# Altium project EnvMonitor V1.0a.PrjPcb
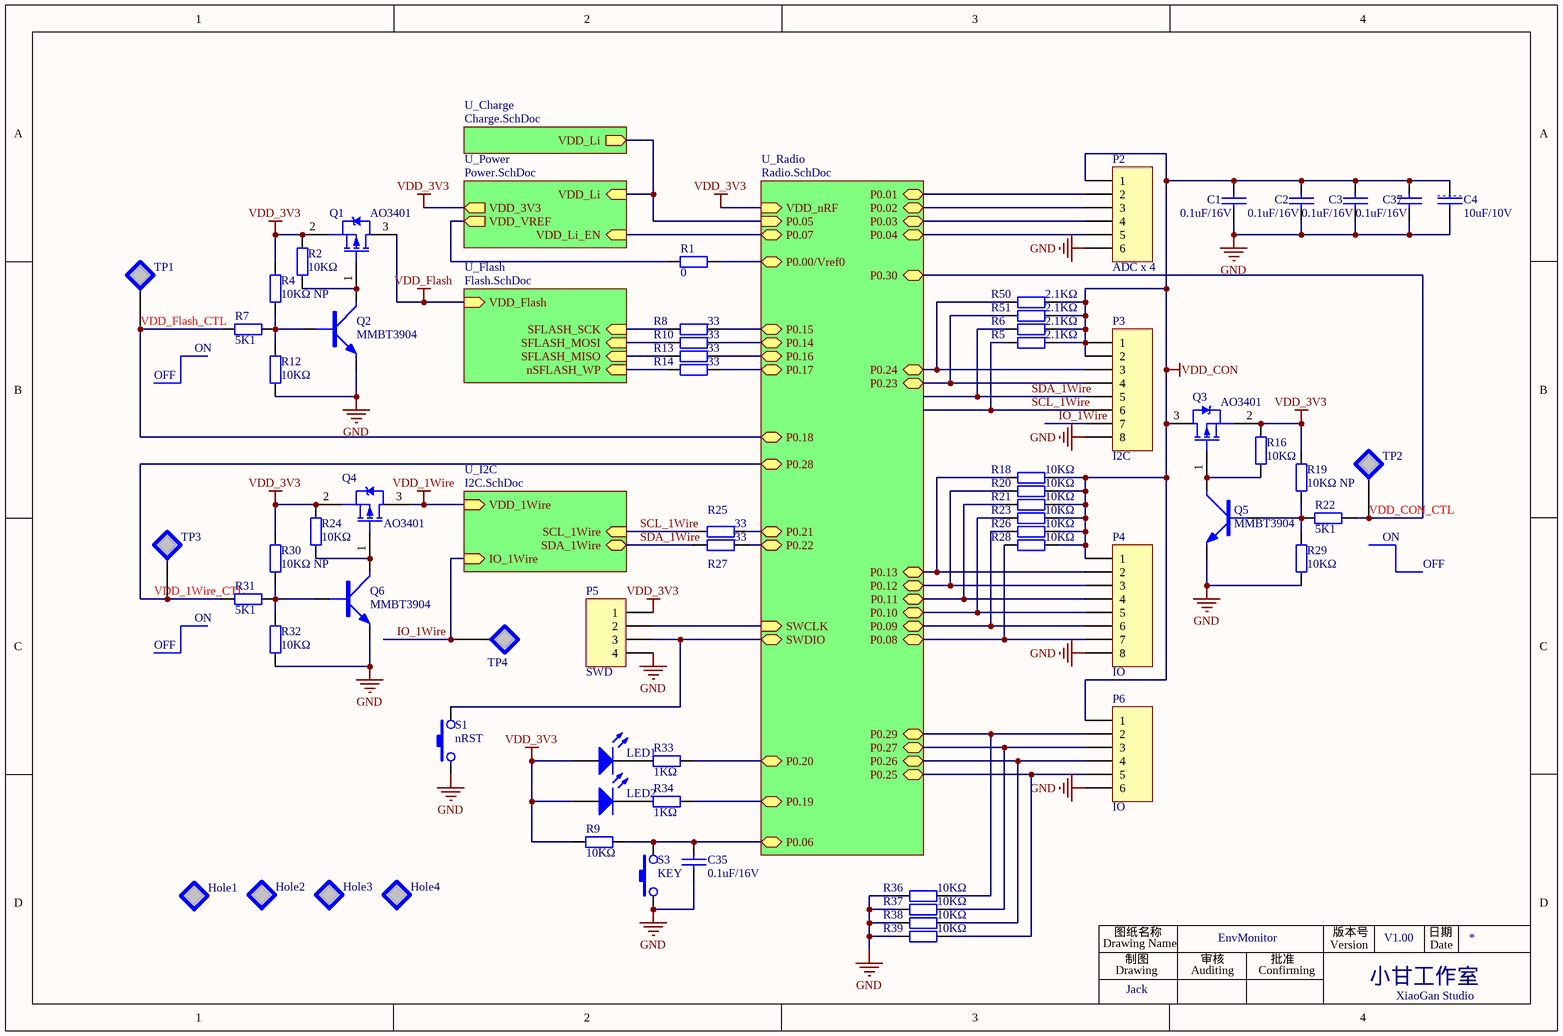
[diagram p0: EnvMonitor.SchDoc]
6 sheets, 186 parts. Net scope: hierarchical (ports join the sheet entries above them; power ports are global).
Board file: EnvMonitor V1.0a.PcbDoc
Sheets:
  EnvMonitor.SchDoc
    U_Radio = Radio.SchDoc
    U_Flash = Flash.SchDoc
    U_Power = Power.SchDoc
    U_I2C = I2C.SchDoc
    U_Charge = Charge.SchDoc

## Sheet EnvMonitor.SchDoc
size A4

### Parts
C1  0.1uF/16V  [0603R]
C2  0.1uF/16V  [0603R]
C3  0.1uF/16V  [0603R]
C4  10uF/10V  [0805R]
C35  0.1uF/16V  [0603R]
C37  0.1uF/16V  [0603R]
Hole1  (no value)  [HOLE-3.2]  (no BOM)
Hole2  (no value)  [HOLE-3.2]  (no BOM)
Hole3  (no value)  [HOLE-3.2]  (no BOM)
Hole4  (no value)  [HOLE-3.2]  (no BOM)
LED1  LED_0603  [LED-0603]  (value not drawn)
LED2  LED_0603  [LED-0603]  (value not drawn)
P2  ADC x 4  [CON6-2.0]
P3  I2C  [CON8-2.0]
P4  IO  [CON8-2.0]
P5  SWD  [CON4-2.0]
P6  IO  [CON6-2.0]
Q1  AO3401  [SOT-23]
Q2  MMBT3904  [SOT-23]
Q3  AO3401  [SOT-23]
Q4  AO3401  [SOT-23]
Q5  MMBT3904  [SOT-23]
Q6  MMBT3904  [SOT-23]
R1  0  [0603R]
R2  10KΩ  [0603R]
R4  10KΩ NP  [0603R]
R5  2.1KΩ  [0603R]
R6  2.1KΩ  [0603R]
R7  5K1  [0603R]
R8  33  [0603R]
R9  10KΩ  [0603R]
R10  33  [0603R]
R12  10KΩ  [0603R]
R13  33  [0603R]
R14  33  [0603R]
R16  10KΩ  [0603R]
R18  10KΩ  [0603R]
R19  10KΩ NP  [0603R]
R20  10KΩ  [0603R]
R21  10KΩ  [0603R]
R22  5K1  [0603R]
R23  10KΩ  [0603R]
R24  10KΩ  [0603R]
R25  33  [0603R]
R26  10KΩ  [0603R]
R27  33  [0603R]
R28  10KΩ  [0603R]
R29  10KΩ  [0603R]
R30  10KΩ NP  [0603R]
R31  5K1  [0603R]
R32  10KΩ  [0603R]
R33  1KΩ  [0603R]
R34  1KΩ  [0603R]
R36  10KΩ  [0603R]
R37  10KΩ  [0603R]
R38  10KΩ  [0603R]
R39  10KΩ  [0603R]
R50  2.1KΩ  [0603R]
R51  2.1KΩ  [0603R]
S1  nRST  [KEY-6S]
S3  KEY  [KEY-6S]
TP1  (no value)  [MARKER-C]  (no BOM)
TP2  (no value)  [MARKER-C]  (no BOM)
TP3  (no value)  [MARKER-C]  (no BOM)
TP4  (no value)  [MARKER-C]  (no BOM)

### Sub-sheets
U_Charge = Charge.SchDoc: VDD_Li (out)
U_Flash = Flash.SchDoc: SFLASH_SCK (in), SFLASH_MOSI (in), SFLASH_MISO (in), nSFLASH_WP (in), VDD_Flash (in)
U_I2C = I2C.SchDoc: VDD_1Wire (in), IO_1Wire (in), SDA_1Wire (bidir), SCL_1Wire (in)
U_Power = Power.SchDoc: VDD_Li (in), VDD_3V3 (out), VDD_VREF (out), VDD_Li_EN (in)
U_Radio = Radio.SchDoc: SWDIO (bidir), SWCLK (in), P0.00/Vref0 (bidir), P0.01 (bidir), P0.02 (bidir), P0.03 (bidir), P0.04 (bidir), P0.05 (in), P0.06 (bidir), P0.07 (bidir), P0.08 (bidir), P0.09 (bidir), P0.10 (bidir), P0.11 (bidir), P0.12 (bidir), P0.13 (bidir), P0.14 (bidir), P0.15 (bidir), P0.16 (bidir), P0.17 (bidir), P0.18 (bidir), P0.19 (bidir), P0.20 (bidir), P0.21 (bidir), P0.22 (bidir), P0.23 (bidir), P0.24 (bidir), P0.25 (bidir), P0.26 (bidir), P0.27 (bidir), P0.28 (bidir), P0.29 (bidir), P0.30 (bidir), VDD_nRF (in)

### Nets
GND: C1.2 C2.2 C3.2 C4.2 C35.1 C37.2 P2.6 P3.8 P4.8 P5.4 P6.6 Q2.2 Q5.2 Q6.2 R12.1 R29.1 R32.1 R36.2 R37.2 R38.2 R39.2 S1.1 S3.1
VDD_1Wire: Q4.3(D) ; sheet U_I2C/VDD_1Wire
VDD_3V3: LED1.1(A) LED2.1(A) P5.1 Q1.2(S) Q3.2(S) Q4.2(S) R2.2 R4.2 R9.2 R16.2 R19.2 R24.2 R30.2 ; sheet U_Radio/VDD_nRF, sheet U_Power/VDD_3V3
VDD_CON: C1.1 C2.1 C3.1 C4.1 C37.1 P2.1 P3.1 P3.2 P4.1 P6.1 Q3.3(D) R5.1 R6.1 R18.1 R20.1 R21.1 R23.1 R26.1 R28.1 R50.2 R51.2
VDD_Flash: Q1.3(D) ; sheet U_Flash/VDD_Flash
IO_1Wire: P3.7 TP4.0 ; sheet U_I2C/IO_1Wire
nSFLASH_WP: R14.2 ; sheet U_Flash/nSFLASH_WP
P0.00/Vref0: R1.1 ; sheet U_Radio/P0.00/Vref0
P0.01: P2.2 ; sheet U_Radio/P0.01
P0.02: P2.3 ; sheet U_Radio/P0.02
P0.03: P2.4 ; sheet U_Radio/P0.03
P0.04: P2.5 ; sheet U_Radio/P0.04
P0.05: sheet U_Radio/P0.05, sheet U_Power/VDD_Li, sheet U_Charge/VDD_Li
P0.06: C35.2 R9.1 S3.2 ; sheet U_Radio/P0.06
P0.07: sheet U_Radio/P0.07, sheet U_Power/VDD_Li_EN
P0.08: P4.7 R28.2 ; sheet U_Radio/P0.08
P0.09: P4.6 R26.2 ; sheet U_Radio/P0.09
P0.10: P4.5 R23.2 ; sheet U_Radio/P0.10
P0.11: P4.4 R21.2 ; sheet U_Radio/P0.11
P0.12: P4.3 R20.2 ; sheet U_Radio/P0.12
P0.13: P4.2 R18.2 ; sheet U_Radio/P0.13
P0.14: R10.1 ; sheet U_Radio/P0.14
P0.15: R8.1 ; sheet U_Radio/P0.15
P0.16: R13.1 ; sheet U_Radio/P0.16
P0.17: R14.1 ; sheet U_Radio/P0.17
P0.19: R34.1 ; sheet U_Radio/P0.19
P0.20: R33.1 ; sheet U_Radio/P0.20
P0.21: R25.1 ; sheet U_Radio/P0.21
P0.22: R27.1 ; sheet U_Radio/P0.22
P0.23: P3.4 R51.1 ; sheet U_Radio/P0.23
P0.24: P3.3 R50.1 ; sheet U_Radio/P0.24
P0.25: P6.5 R39.1 ; sheet U_Radio/P0.25
P0.26: P6.4 R38.1 ; sheet U_Radio/P0.26
P0.27: P6.3 R37.1 ; sheet U_Radio/P0.27
P0.29: P6.2 R36.1 ; sheet U_Radio/P0.29
SCL_1Wire: P3.6 R5.2 R25.2 ; sheet U_I2C/SCL_1Wire
SDA_1Wire: P3.5 R6.2 R27.2 ; sheet U_I2C/SDA_1Wire
SFLASH_MISO: R13.2 ; sheet U_Flash/SFLASH_MISO
SFLASH_MOSI: R10.2 ; sheet U_Flash/SFLASH_MOSI
SFLASH_SCK: R8.2 ; sheet U_Flash/SFLASH_SCK
SWCLK: P5.2 ; sheet U_Radio/SWCLK
SWDIO: P5.3 S1.2 ; sheet U_Radio/SWDIO
VDD_1Wire_CTL: R31.2 TP3.0 ; sheet U_Radio/P0.28  [project net P0.28]
VDD_CON_CTL: R22.2 TP2.0 ; sheet U_Radio/P0.30  [project net P0.30]
VDD_Flash_CTL: R7.2 TP1.0 ; sheet U_Radio/P0.18  [project net P0.18]
VDD_VREF: R1.2 ; sheet U_Power/VDD_VREF
NetLED1_2: LED1.2(K) R33.2
NetLED2_2: LED2.2(K) R34.2
NetQ1_1: Q1.1(G) Q2.3 R2.1
NetQ2_1: Q2.1 R4.1 R7.1 R12.2
NetQ3_1: Q3.1(G) Q5.3 R16.1
NetQ4_1: Q4.1(G) Q6.3 R24.1
NetQ5_1: Q5.1 R19.1 R22.1 R29.2
NetQ6_1: Q6.1 R30.1 R31.1 R32.2

Not connected (* = marked no-connect by the designer): Hole1 0; Hole2 0; Hole3 0; Hole4 0

### Notes on the sheet
- OFF
- (near R7) ON
- (near R22) ON
- (near R31) ON
- Drawing Name
- 图纸名称
- Drawing
- 制图
- Auditing
- 审核
- EnvMonitor
- Confirming
- 批准
- Version
- 版本号
- 小甘工作室
- V1.00
- 日期
- Date
- Jack
- XiaoGan Studio

### Library data of the parts
C1-C4 C35 C37 = CAP: 贴片陶瓷电容; Kind: 贴片陶瓷电容
  C4: Author: 叶建峰
Hole1-Hole4 TP1-TP4 = TESTPOINT: Test Point; Author: 叶建峰
LED1 LED2 = LED_0603: LED_0603 Typical RED, GREEN, YELLOW, AMBER GaAs LED; Type: RED; Package: 0603
P2 P6 = Header 6: Header, 6-Pin; LatestRevisionDate: 17-Jul-2002; LatestRevisionNote: Re-released for DXP Platform.; Publisher: Altium Limited
P3 P4 = Header 8: Header, 8-Pin; LatestRevisionDate: 17-Jul-2002; LatestRevisionNote: Re-released for DXP Platform.; Publisher: Altium Limited
P5 = Header 4: Header, 4-Pin; LatestRevisionDate: 17-Jul-2002; LatestRevisionNote: Re-released for DXP Platform.; Publisher: Altium Limited
Q1 Q3 Q4 = DMP3098L: -30V,-3.8A   PMOS  70-120mΩ; Manufacturer: DIODES; Kind: 贴片MOS管; Remark: 关键元器件
Q2 Q5 Q6 = 9013: NPN三极管; Kind: 贴片三极管
R1 R2 R4-R10 R12-R14 R16 R18-R34 R36-R39 R50 R51 = RES_0603: OEMs: *; Type: 10KΩ; Package: 0603
S1 S3 = SW-PB

## Sheet Radio.SchDoc: PCA100024 - Radio
size A4; Revision: 1.0.0; SheetNumber: 1; SheetTotal: 3; DrawnBy: RUBR; ProjectNumber: 4400; PCBRevision: 0141RUBR; DocumentSize: A4; PCAName: PCA10024; PCBNumber: 400081; ProjectName: nRF51822 mbed
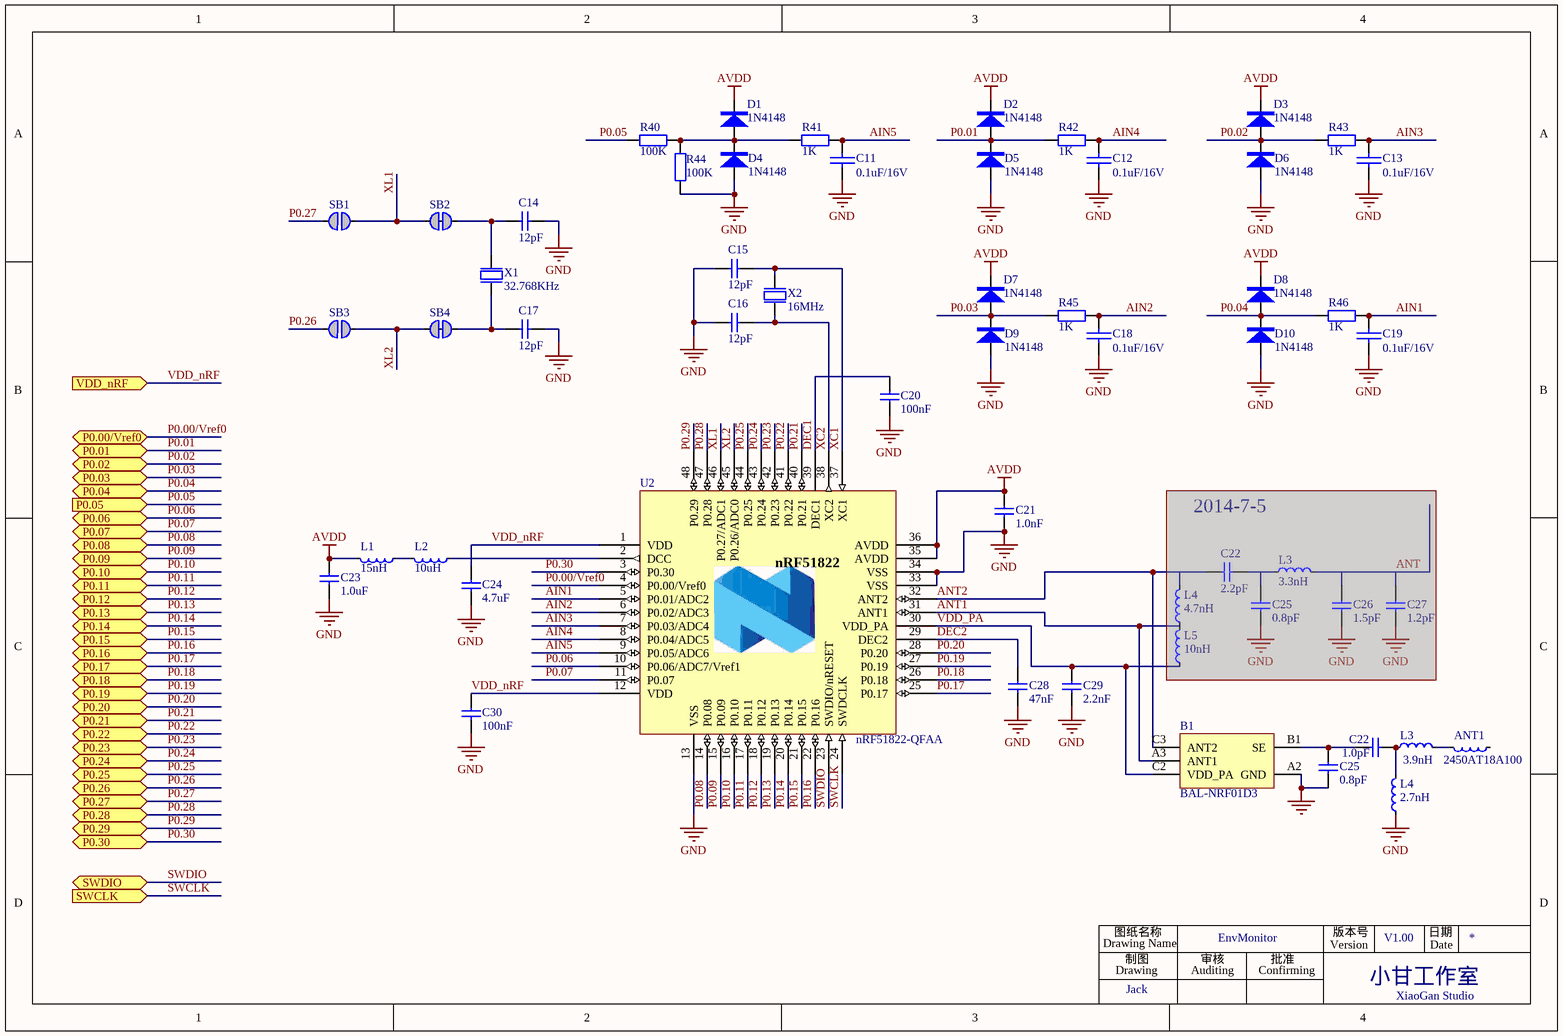
[diagram p1: Radio.SchDoc]

### Parts
(Parts that share a designator on the sheet are numbered #1, #2 ... from top to bottom, then left to right.)
ANT1  2450AT18A100
B1  BAL-NRF01D3  [BAL-ST-WLCSP]
C11  0.1uF/16V  [0603R]
C12  0.1uF/16V  [0603R]
C13  0.1uF/16V  [0603R]
C14  12pF  [0603R]
C15  12pF  [0603R]
C16  12pF  [0603R]
C17  12pF  [0603R]
C18  0.1uF/16V  [0603R]
C19  0.1uF/16V  [0603R]
C20  100nF  [0603R]
C21  1.0nF  [0603R]
C22#1  2.2pF  [0603R]  (masked out: inside a compile mask, not in the netlist)
C22#2  1.0pF  [0402c]
C23  1.0uF  [0603R]
C24  4.7uF  [0603R]
C25#1  0.8pF  [0603R]  (masked out: inside a compile mask, not in the netlist)
C25#2  0.8pF  [0402c]
C26  1.5pF  [0603R]  (masked out: inside a compile mask, not in the netlist)
C27  1.2pF  [0603R]  (masked out: inside a compile mask, not in the netlist)
C28  47nF  [0603R]
C29  2.2nF  [0603R]
C30  100nF  [0603R]
D1  1N4148  [SOD-123]
D2  1N4148  [SOD-123]
D3  1N4148  [SOD-123]
D4  1N4148  [SOD-123]
D5  1N4148  [SOD-123]
D6  1N4148  [SOD-123]
D7  1N4148  [SOD-123]
D8  1N4148  [SOD-123]
D9  1N4148  [SOD-123]
D10  1N4148  [SOD-123]
L1  15nH  [0603R]
L2  10uH  [0603R]
L3#1  3.3nH  [0603R]  (masked out: inside a compile mask, not in the netlist)
L3#2  3.9nH  [0402R]
L4#1  4.7nH  [0603R]  (masked out: inside a compile mask, not in the netlist)
L4#2  2.7nH  [0402R]
L5  10nH  [0603R]  (masked out: inside a compile mask, not in the netlist)
R40  100K  [0603R]
R41  1K  [0603R]
R42  1K  [0603R]
R43  1K  [0603R]
R44  100K  [0603R]
R45  1K  [0603R]
R46  1K  [0603R]
SB1  Solderbridge  [Solderbridge]  (value not drawn)  (no BOM)
SB2  Solderbridge  [Solderbridge_Shorted]  (value not drawn)  (net tie, no BOM)
SB3  Solderbridge  [Solderbridge]  (value not drawn)  (no BOM)
SB4  Solderbridge  [Solderbridge_Shorted]  (value not drawn)  (net tie, no BOM)
U2  nRF51822-QFAA  [QFN40P600X600X90-48N]
X1  32.768KHz  [CRY-32]
X2  16MHz  [XTAL-D]

### Ports
P0.00/Vref0 (bidir), P0.01 (bidir), P0.02 (bidir), P0.03 (bidir), P0.04 (bidir), P0.05 (in), P0.06 (bidir), P0.07 (bidir), P0.08 (bidir), P0.09 (bidir), P0.10 (bidir), P0.11 (bidir), P0.12 (bidir), P0.13 (bidir), P0.14 (bidir), P0.15 (bidir), P0.16 (bidir), P0.17 (bidir), P0.18 (bidir), P0.19 (bidir), P0.20 (bidir), P0.21 (bidir), P0.22 (bidir), P0.23 (bidir), P0.24 (bidir), P0.25 (bidir), P0.26 (bidir), P0.27 (bidir), P0.28 (bidir), P0.29 (bidir), P0.30 (bidir), SWCLK (in), SWDIO (bidir), VDD_nRF (in)

### Nets
AVDD: C21.1 C23.2 D1.2 D2.2 D3.2 D7.2 D8.2 L1.2 U2.35(AVDD) U2.36(AVDD)
GND: B1.A2(GND) C11.2(P2) C12.2(P2) C13.2(P2) C14.2 C15.2 C16.2 C17.2 C18.2(P2) C19.2(P2) C20.2 C21.2 C23.1 C24.2 C25#2.1 C28.2 C29.2 C30.2 D4.1 D5.1 D6.1 D9.1 D10.1 L4#2.1 R44.1 U2.13(VSS) U2.33(VSS) U2.34(VSS) U2.49
VDD_nRF: C24.1 C30.1 U2.1(VDD) U2.12(VDD) ; port VDD_nRF  [project net VDD_3V3]
AIN1: C19.1(P1) R46.2 U2.5(P0.01/ADC2)
AIN2: C18.1(P1) R45.2 U2.6(P0.02/ADC3)
AIN3: C13.1(P1) R43.2 U2.7(P0.03/ADC4)
AIN4: C12.1(P1) R42.2 U2.8(P0.04/ADC5)
AIN5: C11.1(P1) R41.2 U2.9(P0.05/ADC6)
ANT1: B1.A3(ANT1) U2.31(ANT1)
ANT2: B1.C3(ANT2) U2.32(ANT2)
DEC1: C20.1 U2.39(DEC1)
DEC2: C28.1 U2.29(DEC2)
P0.00/Vref0: U2.4(P0.00/Vref0) ; port P0.00/Vref0
P0.01: D2.1 D5.2 R42.1 ; port P0.01
P0.02: D3.1 D6.2 R43.1 ; port P0.02
P0.03: D7.1 D9.2 R45.1 ; port P0.03
P0.04: D8.1 D10.2 R46.1 ; port P0.04
P0.05: R40.2 ; port P0.05
P0.06: U2.10(P0.06/ADC7/Vref1) ; port P0.06
P0.07: U2.11(P0.07) ; port P0.07
P0.08: U2.14(P0.08) ; port P0.08
P0.09: U2.15(P0.09) ; port P0.09
P0.10: U2.16(P0.10) ; port P0.10
P0.11: U2.17(P0.11) ; port P0.11
P0.12: U2.18(P0.12) ; port P0.12
P0.13: U2.19(P0.13) ; port P0.13
P0.14: U2.20(P0.14) ; port P0.14
P0.15: U2.21(P0.15) ; port P0.15
P0.16: U2.22(P0.16) ; port P0.16
P0.17: U2.25(P0.17) ; port P0.17
P0.18: U2.26(P0.18) ; port P0.18
P0.19: U2.27(P0.19) ; port P0.19
P0.20: U2.28(P0.20) ; port P0.20
P0.21: U2.40(P0.21) ; port P0.21
P0.22: U2.41(P0.22) ; port P0.22
P0.23: U2.42(P0.23) ; port P0.23
P0.24: U2.43(P0.24) ; port P0.24
P0.25: U2.44(P0.25) ; port P0.25
P0.26: SB3.2 ; port P0.26
P0.27: SB1.2 ; port P0.27
P0.28: U2.47(P0.28) ; port P0.28
P0.29: U2.48(P0.29) ; port P0.29
P0.30: U2.3(P0.30) ; port P0.30
SWCLK: U2.24(SWDCLK) ; port SWCLK
SWDIO: U2.23(SWDIO/nRESET) ; port SWDIO
VDD_PA: B1.C2(VDD_PA) C29.1 U2.30(VDD_PA)
XC1: C15.1 U2.37(XC1) X2.2(out)
XC2: C16.1 U2.38(XC2) X2.1(inp)
XL1: SB1.1 SB2.2 U2.46(P0.27/ADC1)
XL2: SB3.1 SB4.2 U2.45(P0.26/ADC0)
NetANT1_2: ANT1.2 L3#2.2
NetB1_B1: B1.B1(SE) C22#2.1 C25#2.2
NetC14_1: C14.1 SB2.1 X1.2(out)
NetC17_1: C17.1 SB4.1 X1.1(inp)
NetC22#2_2: C22#2.2 L3#2.1 L4#2.2
NetD1_1: D1.1 D4.2 R40.1 R41.1 R44.2
NetL1_1: L1.1 L2.2
NetL2_1: L2.1 U2.2(DCC)

Not connected (* = marked no-connect by the designer): ANT1 1

### Notes on the sheet
- 2014-7-5
- Drawing Name
- 图纸名称
- Drawing
- 制图
- Auditing
- 审核
- EnvMonitor
- Confirming
- 批准
- Version
- 版本号
- 小甘工作室
- V1.00
- 日期
- Date
- Jack
- XiaoGan Studio
- (in symbol nRF51822_QFAA) nRF51822

### Library data of the parts
ANT1 L3#2 L4#2 = L0402-3n3: Inductor, 190mA, ?.1nH; Manufacturer: Murata; Manufacturer Part Number: LQP15MN3N3B02D; Value: 3.3nH; Note: High frequency chip inductor ?%; Artikkelnr Noca: 33029369; Part Number: L0402-3n3; Datasheet: http://search.murata.co.jp/Ceramy/image/img/PDF/ENG/L0075S0084LQP15M.pdf; LatestRevisionDate: 2012-09-19; Pin Count: 2; Publisher: Nordic Semiconductor; Published: 2009-05-08; Supplier: Digi-Key; Supplier part number: 490-1130-1-ND; 2nd source Supplier: *; 2nd source part number: *
B1 = BAL-NRF02D3: 50 ohm balun transformer for 2.45GHz ISM; Manufacturer: ST; Artikkelnr Noca: N.A.; Part Number: BAL-NRF02D3; Manufacturer Part Number: BAL-NRF02D3; Datasheet: *; LatestRevisionDate: 2013-05-15; Pin Count: 5; Publisher: Nordic Semiconductor; Published: 2013-05-15; Value: BAL-NRF02D3; Note: BAL-NRF02D3; Supplier: *; Supplier part number: *; 2nd source Supplier: *; 2nd source part number: *
C11-C13 C18 C19 = CAP: 贴片陶瓷电容; Kind: 贴片陶瓷电容
C14-C17 = C0402-12p: Capacitor, NP0, ?%; Note: 50V; Artikkelnr Noca: 20029159; Part Number: C0402-12p; Manufacturer: *; Manufacturer Part Number: *; Datasheet: *; LatestRevisionDate: 2011-05-11; Pin Count: 2; Publisher: Nordic Semiconductor; Published: 2009-05-08; Value: 12pF; Supplier: *; Supplier part number: *; 2nd source Supplier: *; 2nd source part number: *
C20 C30 = C0402-100n: Capacitor, X7R, ?0%; Note: 16V; Artikkelnr Noca: 20039200; Part Number: C0402-100n; Manufacturer: *; Manufacturer Part Number: *; Datasheet: *; LatestRevisionDate: 2009-11-23; Pin Count: 2; Publisher: Nordic Semiconductor; Published: 2009-05-08; Value: 100nF; Supplier: *; Supplier part number: *; 2nd source Supplier: *; 2nd source part number: *
C21 = C0402-1n0: Capacitor, X7R, ?0%; Note: 50V; Artikkelnr Noca: 20039223; Part Number: C0402-1n0; Manufacturer: *; Manufacturer Part Number: *; Datasheet: *; LatestRevisionDate: 2009-11-23; Pin Count: 2; Publisher: Nordic Semiconductor; Published: 2009-05-08; Value: 1.0nF; Supplier: *; Supplier part number: *; 2nd source Supplier: *; 2nd source part number: *
C22#1 = C0402-2.2p: Capacitor, NP0, ?.1pF; Note: 50V; Artikkelnr Noca: 20029145; Part Number: C0402-2.2p; Manufacturer: *; Manufacturer Part Number: *; Datasheet: *; LatestRevisionDate: 2009-05-08; Pin Count: 2; Publisher: Nordic Semiconductor; Published: 2009-05-08; Value: 2.2pF; Supplier: *; Supplier part number: *; 2nd source Supplier: *; 2nd source part number: *
C22#2 = C0402-0.8p: Capacitor, NP0, ?%; Value: 0.8pF; Note: 50V; Artikkelnr Noca: 20029147; Part Number: C0402-0.8p; Manufacturer: *; Manufacturer Part Number: *; Datasheet: *; LatestRevisionDate: 2012-11-21; Pin Count: 2; Publisher: Nordic Semiconductor; Published: 2009-05-08; Supplier: *; Supplier part number: *; 2nd source Supplier: *; 2nd source part number: *
C23 = C0603-1?: Capacitor, X7R, ?0%; Value: 1.0µF; Note: 16V; Artikkelnr Noca: 20039335; Part Number: C0603-1?; Manufacturer: *; Manufacturer Part Number: *; Datasheet: *; Footprint: 0603; LatestRevisionDate: 2013-06-05; Pin Count: 2; Publisher: Nordic Semiconductor; Published: 2009-05-08; Supplier: *; Supplier part number: *; 2nd source Supplier: *; 2nd source part number: *
C24 = C0603-4?: Capacitor, X5R, ?0%; Value: 4.7µF; Note: 6.3V; Artikkelnr Noca: 20069060; Part Number: C0603-4?; Manufacturer: *; Manufacturer Part Number: *; Datasheet: *; Footprint: 0603; LatestRevisionDate: 2009-11-23; Pin Count: 2; Publisher: Nordic Semiconductor; Published: 2009-05-08; Supplier: *; Supplier part number: *; 2nd source Supplier: *; 2nd source part number: *
C25#1 C25#2 = C0402-0.8p: Capacitor, NP0, ?%; Note: 50V; Artikkelnr Noca: 20029147; Part Number: C0402-0.8p; Manufacturer: *; Manufacturer Part Number: *; Datasheet: *; LatestRevisionDate: 2012-11-21; Pin Count: 2; Publisher: Nordic Semiconductor; Published: 2009-05-08; Value: 0.8pF; Supplier: *; Supplier part number: *; 2nd source Supplier: *; 2nd source part number: *
C26 = C0402-1.5p: Capacitor, NP0, ?.1pF; Note: 50V; Artikkelnr Noca: 20029139; Part Number: C0402-1.5p; Manufacturer: *; Manufacturer Part Number: *; Datasheet: *; LatestRevisionDate: 2009-11-23; Pin Count: 2; Publisher: Nordic Semiconductor; Published: 2009-05-08; Value: 1.5pF; Supplier: *; Supplier part number: *; 2nd source Supplier: *; 2nd source part number: *
C27 = C0402-1.2p: Capacitor, NP0, ?.1pF; Note: 50V; Artikkelnr Noca: 20029157; Part Number: C0402-1.2p; Manufacturer: *; Manufacturer Part Number: *; Datasheet: *; LatestRevisionDate: 2011-05-11; Pin Count: 2; Publisher: Nordic Semiconductor; Published: 2009-05-08; Value: 1.2pF; Supplier: *; Supplier part number: *; 2nd source Supplier: *; 2nd source part number: *
C28 = C0402-47n: Capacitor, X7R, ?0%; Note: Chip Cap 10%; Artikkelnr Noca: 20039389; Part Number: C0402-47n; Manufacturer: *; Manufacturer Part Number: *; Datasheet: *; LatestRevisionDate: 2009-05-08; Pin Count: 2; Publisher: Nordic Semiconductor; Published: 2009-05-08; Value: 47nF; Supplier: *; Supplier part number: *; 2nd source Supplier: *; 2nd source part number: *
C29 = C0402-2n2: Capacitor, X7R, ?0%; Note: 50V; Artikkelnr Noca: 20039221; Part Number: C0402-2n2; Manufacturer: *; Manufacturer Part Number: *; Datasheet: *; LatestRevisionDate: 2009-11-23; Pin Count: 2; Publisher: Nordic Semiconductor; Published: 2009-05-08; Value: 2.2nF; Supplier: *; Supplier part number: *; 2nd source Supplier: *; 2nd source part number: *
D1-D10 = DIODE: 贴片二极管; Remark: 可用1N5819替代; Kind: 贴片二极管
L1 = L0402-15n: Inductor, 320mA, ?%; Manufacturer: Taiyo Yuden; Manufacturer Part Number: HK100515NJ-T; 2nd source part number: 658-1328; Note: High frequency chip inductor ?0%; Artikkelnr Noca: 33029323; Part Number: L0402-15n; LatestRevisionDate: 2012-09-19; Pin Count: 2; Publisher: Nordic Semiconductor; Published: 2010-07-12; Value: 15nH; Supplier: Digi-Key; Datasheet: http://www.yuden.co.jp/productdata/catalog/en/mlci04_e.pdf; Supplier part number: 587-1521-1-ND; 2nd source Supplier: Farnell
L2 = L0603-10?: Inductor, 80mA, ?0%; Part Number: L0603-10祹ISHIDDEN=T; Manufacturer: Taiyo Yuden; Manufacturer Part Number: LBMF1608T100K; 2nd source part number: 178-6105; Value: 10µH; Note: LBMF1608T100K 10µH 80mA 0603; Artikkelnr Noca: 33029314; Datasheet: http://www.yuden.co.jp/ut/product/pdf/elb2_e.pdf; LatestRevisionDate: 2012-09-19; Pin Count: 2; Publisher: Nordic Semiconductor; Published: 2010-02-24; Supplier: Digi-Key; Supplier part number: 587-1714-1-ND; 2nd source Supplier: Farnell
L3#1 = L0402-3n3: Inductor, 190mA, ?.1nH; Manufacturer: Murata; Manufacturer Part Number: LQP15MN3N3B02D; Note: High frequency chip inductor ?%; Artikkelnr Noca: 33029369; Part Number: L0402-3n3; Datasheet: http://search.murata.co.jp/Ceramy/image/img/PDF/ENG/L0075S0084LQP15M.pdf; LatestRevisionDate: 2012-09-19; Pin Count: 2; Publisher: Nordic Semiconductor; Published: 2009-05-08; Value: 3.3nH; Supplier: Digi-Key; Supplier part number: 490-1130-1-ND; 2nd source Supplier: *; 2nd source part number: *
L4#1 = L0402-4n7: Inductor, 160mA, ?.1nH; Manufacturer: Murata; Manufacturer Part Number: LQP15MN4N7B02D; Note: High frequency chip inductor ?%; Artikkelnr Noca: 33029164; Part Number: L0402-4n7; Datasheet: http://search.murata.co.jp/Ceramy/image/img/PDF/ENG/L0075S0084LQP15M.pdf; LatestRevisionDate: 2012-09-19; Pin Count: 2; Publisher: Nordic Semiconductor; Published: 2009-05-08; Value: 4.7nH; Supplier: Digi-Key; Supplier part number: 490-1132-1-ND; 2nd source Supplier: *; 2nd source part number: *
L5 = L0402-10n: Inductor, 100mA, ?%; Manufacturer: Murata; Manufacturer Part Number: LQP15MN10NG02D; Note: High frequency chip inductor ?%; Artikkelnr Noca: 33029425; Part Number: L0402-10n; Datasheet: http://search.murata.co.jp/Ceramy/image/img/PDF/ENG/L0075S0084LQP15M.pdf; LatestRevisionDate: 2012-09-19; Pin Count: 2; Publisher: Nordic Semiconductor; Published: 2010-07-12; Value: 10nH; Supplier: Mouser; Supplier part number: 81-LQP15MN10NG02D; 2nd source Supplier: *; 2nd source part number: *
R40-R46 = RES_0603: OEMs: *; Type: 10KΩ; Package: 0603
SB1 SB3 = Solderbridge: Artikkelnr Noca: N.A.; Part Number: Solderbridge; Manufacturer: *; Manufacturer Part Number: *; Datasheet: *; LatestRevisionDate: 2009-12-14; Pin Count: 2; Publisher: Nordic Semiconductor; Published: 2009-12-14; Value: Solderbridge; Note: *; Supplier: *; Supplier part number: *; 2nd source Supplier: *; 2nd source part number: *
SB2 SB4 = Solderbridge Shorted: Shorted Solderbridge; Artikkelnr Noca: N.A.; Part Number: Solderbridge Shorted; Manufacturer: *; Manufacturer Part Number: *; Datasheet: *; LatestRevisionDate: 2012-08-07; Pin Count: 2; Publisher: Nordic Semiconductor; Published: 2012-08-07; Value: Solderbridge; Note: *; Supplier: *; Supplier part number: *; 2nd source Supplier: *; 2nd source part number: *
U2 = nRF51822_QFAA: Multi-protocol Bluetooth Low Energy and 2.4GHz proprietary system-on-chip; Part Number: nRF51822-QFAA-XLR2.4; Manufacturer: Nordic Semiconductor; Manufacturer Part Number: nRF51822-QFAAGx; Note: nRF51822 - QFN48 6x6 0.4mm pitch; Artikkelnr Noca: 15079242; Datasheet: *; Footprint: QFN-48; LatestRevisionDate: 2013-10-18; Pin Count: 48; Publisher: Nordic Semiconductor; Published: 2013-09-04; Value: nRF51822-QFAA; Supplier: Nordic Semiconductor; Supplier part number: *; 2nd source Supplier: *; 2nd source part number: *
X1 X2 = XTAL_FC-135 32.768k: EPSON TOYOCOM - FC-135 32.768KHZ ?0PPM,9.0PF - CRYSTAL, SM, WATCH; 2nd source part number: 127-8037; Note: XTAL SMD 32.768kHz, 3215; Artikkelnr Noca: 22019091; Part Number: XTAL_FC-135 32.768k; Manufacturer: Epson Toyocom; Manufacturer Part Number: FC-135 32.768KHZ ?0PPM,9.0PF; Datasheet: http://www.farnell.com/datasheets/57480.pdf; Footprint: FC-135; LatestRevisionDate: 2010-10-18; Pin Count: 2; Publisher: Nordic Semiconductor; Published: 2010-10-18; Value: 32.768kHz; Supplier: Digi-Key; Supplier part number: FC-135 32.7680KA-AC-ND; 2nd source Supplier: Farnell

## Sheet Flash.SchDoc
size A4
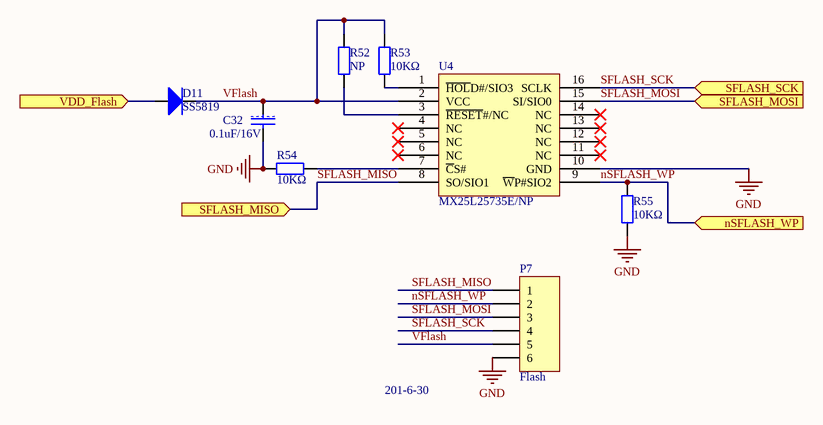
[diagram p2: Flash.SchDoc]

### Parts
C32  0.1uF/16V  [0603R]  (no BOM)
D11  SS5819  [SMA]
P7  Flash  [CON6-2.0]
R52  NP  [0603R]
R53  10KΩ  [0603R]
R54  10KΩ  [0603R]
R55  10KΩ  [0603R]
U4  MX25L25735E/NP  [SOIC16W]  (no BOM)

### Ports
nSFLASH_WP (in), SFLASH_MISO (in), SFLASH_MOSI (in), SFLASH_SCK (in), VDD_Flash (in)

### Nets
GND: C32.2 P7.6 R54.2 R55.2 U4.10(GND)
VDD_Flash: D11.1(A) ; port VDD_Flash
nSFLASH_WP: P7.2 R55.1 U4.9(~{W}P#SIO2) ; port nSFLASH_WP
SFLASH_MISO: P7.1 U4.8(SO/SIO1) ; port SFLASH_MISO
SFLASH_MOSI: P7.3 U4.15(SI/SIO0) ; port SFLASH_MOSI
SFLASH_SCK: P7.4 U4.16(SCLK) ; port SFLASH_SCK
VFlash: C32.1 D11.2(K) P7.5 R52.2 R53.2 U4.2(VCC)
NetR52_1: R52.1 U4.3(~{RESET}#/NC)
NetR53_1: R53.1 U4.1(~{HOL}D#/SIO3)
NetR54_1: R54.1 U4.7(~{C}S#)

Not connected (* = marked no-connect by the designer): U4 4(NC)* 5(NC)* 6(NC)* 11(NC)* 12(NC)* 13(NC)* 14(NC)*

### Notes on the sheet
- 201-6-30
- Drawing Name
- 图纸名称
- Drawing
- 制图
- Auditing
- 审核
- EnvMonitor
- Confirming
- 批准
- Version
- 版本号
- 小甘工作室
- V1.00
- 日期
- Date
- Jack
- XiaoGan Studio

### Library data of the parts
C32 = CAP: 贴片陶瓷电容; Kind: 贴片陶瓷电容; Author: 叶建峰
D11 = Diode 1N914: 贴片二极管; Remark: 可用1N5819替代; Kind: 贴片二极管; Author: 叶建峰
P7 = Header 6: Header, 6-Pin; LatestRevisionDate: 17-Jul-2002; LatestRevisionNote: Re-released for DXP Platform.; Publisher: Altium Limited
R52-R55 = RES_0603: OEMs: *; Type: 10KΩ; Package: 0603
U4 = MX25L25735E: SPI_flash; Manufacturer: MXIC; Kind: 集成电路; Remark: 关键元器件; 规格: 16-PIN SOP(300mil); Author: 杨杰

## Sheet Power.SchDoc
size A4
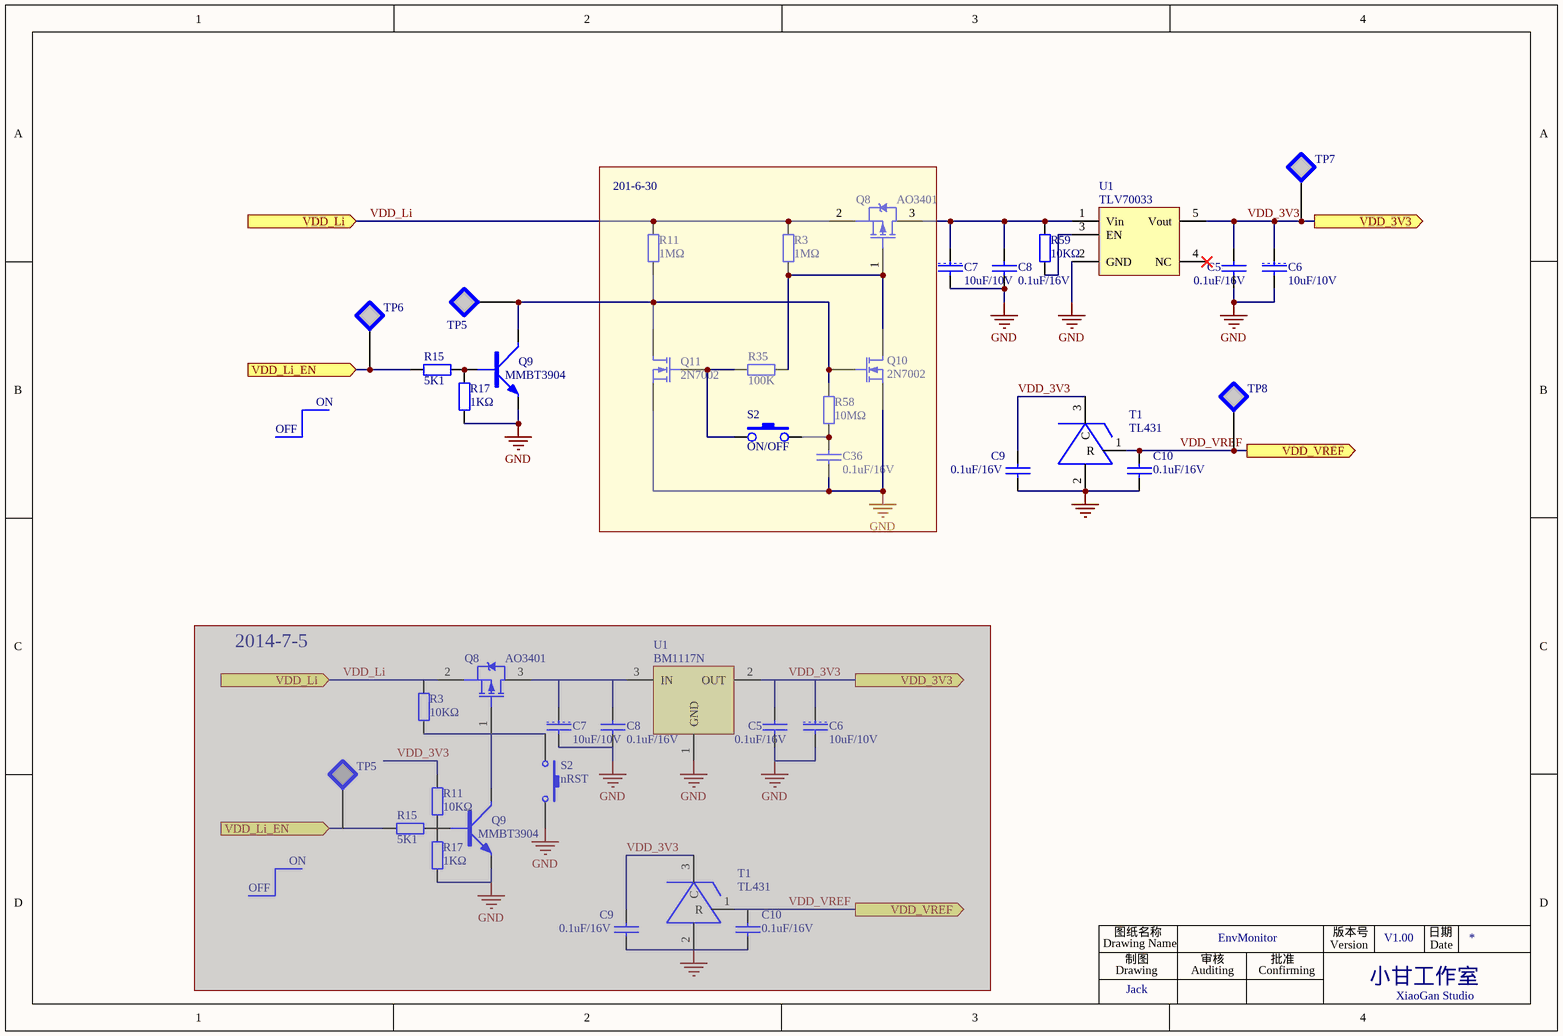
[diagram p3: Power.SchDoc]

### Parts
(Parts that share a designator on the sheet are numbered #1, #2 ... from top to bottom, then left to right.)
C5#1  0.1uF/16V  [0603R]
C5#2  0.1uF/16V  [0603R]  (masked out: inside a compile mask, not in the netlist)
C6#1  10uF/10V  [0805R]
C6#2  10uF/10V  [0805R]  (masked out: inside a compile mask, not in the netlist)
C7#1  10uF/10V  [0805R]
C7#2  10uF/10V  [0805R]  (masked out: inside a compile mask, not in the netlist)
C8#1  0.1uF/16V  [0603R]
C8#2  0.1uF/16V  [0603R]  (masked out: inside a compile mask, not in the netlist)
C9#1  0.1uF/16V  [0603R]
C9#2  0.1uF/16V  [0603R]  (masked out: inside a compile mask, not in the netlist)
C10#1  0.1uF/16V  [0603R]
C10#2  0.1uF/16V  [0603R]  (masked out: inside a compile mask, not in the netlist)
C36  0.1uF/16V  [0805R]
Q8#1  AO3401  [SOT-23]
Q8#2  AO3401  [SOT-23]  (masked out: inside a compile mask, not in the netlist)
Q9#1  MMBT3904  [SOT-23]
Q9#2  MMBT3904  [SOT-23]  (masked out: inside a compile mask, not in the netlist)
Q10  2N7002  [SOT-23]
Q11  2N7002  [SOT-23]
R3#1  1MΩ  [0603R]
R3#2  10KΩ  [0603R]  (masked out: inside a compile mask, not in the netlist)
R11#1  1MΩ  [0603R]
R11#2  10KΩ  [0603R]  (masked out: inside a compile mask, not in the netlist)
R15#1  5K1  [0603R]
R15#2  5K1  [0603R]  (masked out: inside a compile mask, not in the netlist)
R17#1  1KΩ  [0603R]
R17#2  1KΩ  [0603R]  (masked out: inside a compile mask, not in the netlist)
R35  100K  [0603R]
R58  10MΩ  [0603R]
R59  10KΩ  [0603R]
S2#1  ON/OFF  [KEY-6S]
S2#2  nRST  [SPST-2]  (masked out: inside a compile mask, not in the netlist)
T1#1  TL431  [TL-431]
T1#2  TL431  [TL-431]  (masked out: inside a compile mask, not in the netlist)
TP5#1  (no value)  [MARKER-C]  (no BOM)
TP5#2  (no value)  [MARKER-C]  (no BOM)  (masked out: inside a compile mask, not in the netlist)
TP6  (no value)  [MARKER-C]  (no BOM)
TP7  (no value)  [MARKER-C]  (no BOM)
TP8  (no value)  [MARKER-C]  (no BOM)
U1#1  TLV70033  [SOT-23-5]
U1#2  BM1117N  [TO-252]  (masked out: inside a compile mask, not in the netlist)

### Blocks framed on the sheet
201-6-30: C36 Q8#1 Q10 Q11 R3#1 R11#1 R35 R58 S2#1

### Ports
VDD_3V3 (out), VDD_Li (in), VDD_Li_EN (in), VDD_VREF (out)

### Nets
GND: C5#1.2 C6#1.2 C7#1.2 C8#1.2 C9#1.2 C10#1.2 C36.2 Q9#1.2 Q10.2(S) Q11.2(S) R17#1.1 T1#1.2 U1#1.2(GND)
VDD_3V3: C5#1.1 C6#1.1 C9#1.1 T1#1.3(C) TP7.0 U1#1.5(Vout) ; port VDD_3V3
P0.07: R15#1.2 TP6.0 ; port VDD_Li_EN
VDD_Li: Q8#1.2(S) R3#1.2 R11#1.2 ; port VDD_Li  [project net P0.05]
VDD_VREF: C10#1.1 T1#1.1(R) TP8.0 ; port VDD_VREF
NetC7#1_1: C7#1.1 C8#1.1 Q8#1.3(D) R59.2 U1#1.1(Vin)
NetC36_1: C36.1 R58.2 S2#1.2
NetQ8#1_1: Q8#1.1(G) Q10.3(D) R3#1.1 R35.1
NetQ9#1_1: Q9#1.1 R15#1.1 R17#1.2
NetQ9#1_3: Q9#1.3 Q10.1(G) Q11.3(D) R11#1.1 R58.1 TP5#1.0
NetQ11_1: Q11.1(G) R35.2 S2#1.1
NetR59_1: R59.1 U1#1.3(EN)

Not connected (* = marked no-connect by the designer): U1#1 4(NC)*

### Notes on the sheet
- OFF
- ON
- 2014-7-5
- Drawing Name
- 图纸名称
- Drawing
- 制图
- Auditing
- 审核
- EnvMonitor
- Confirming
- 批准
- Version
- 版本号
- 小甘工作室
- V1.00
- 日期
- Date
- Jack
- XiaoGan Studio

### Library data of the parts
C5#1 C5#2 C6#1 C6#2 C7#1 C7#2 C8#1 C8#2 C9#1 C9#2 C10#1 C10#2 C36 = CAP: 贴片陶瓷电容; Kind: 贴片陶瓷电容
  C6#1 C6#2 C7#1 C7#2: Author: 叶建峰
Q8#1 Q8#2 = DMP3098L: as Q1 on sheet EnvMonitor
Q9#1 Q9#2 = 9013: NPN三极管; Kind: 贴片三极管
Q10 Q11 = MOSFET-N: N-Channel MOSFET; PackageDocument: 1995/1996; Published: 8-Jun-2000; LatestRevisionDate: 17-Jul-2002; LatestRevisionNote: Re-released for DXP Platform.; PackageReference: E3; Publisher: Altium Limited
R3#1 R3#2 R11#1 R11#2 R15#1 R15#2 R17#1 R17#2 R35 R58 R59 = RES_0603: OEMs: *; Type: 10KΩ; Package: 0603
S2#1 = SW-PB
S2#2 = SW-PB: Switch; Published: 24-Mar-1999; LatestRevisionDate: 17-Jul-2002; LatestRevisionNote: Re-released for DXP Platform.; PackageReference: SPST-2; Publisher: Altium Limited
TP5#1 TP5#2 TP6-TP8 = TESTPOINT: Test Point; Author: 叶建峰
U1#1 U1#2 = AZ1084

## Sheet I2C.SchDoc
size A4
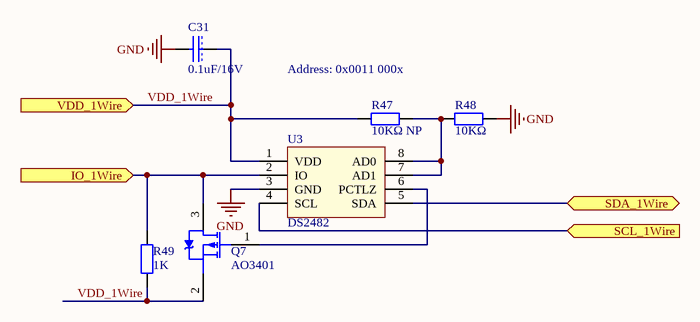
[diagram p4: I2C.SchDoc]

### Parts
C31  0.1uF/16V  [0603R]  (no BOM)
Q7  AO3401  [SOT-23]
R47  10KΩ NP  [0603R]
R48  10KΩ  [0603R]
R49  1K  [0603R]
U3  DS2482  [SO-8]

### Ports
IO_1Wire (in), SCL_1Wire (in), SDA_1Wire (bidir), VDD_1Wire (in)

### Nets
GND: C31.2 R48.1 U3.3(GND)
VDD_1Wire: C31.1 Q7.2(S) R47.2 R49.1 U3.1(VDD) ; port VDD_1Wire
IO_1Wire: Q7.3(D) R49.2 U3.2(IO) ; port IO_1Wire
SCL_1Wire: U3.4(SCL) ; port SCL_1Wire
SDA_1Wire: U3.5(SDA) ; port SDA_1Wire
NetQ7_1: Q7.1(G) U3.6(PCTLZ)
NetR47_1: R47.1 R48.2 U3.7(AD1) U3.8(AD0)

### Notes on the sheet
- Address: 0x0011 000x
- Drawing Name
- 图纸名称
- Drawing
- 制图
- Auditing
- 审核
- EnvMonitor
- Confirming
- 批准
- Version
- 版本号
- 小甘工作室
- V1.00
- 日期
- Date
- Jack
- XiaoGan Studio

### Library data of the parts
C31 = CAP: 贴片陶瓷电容; Kind: 贴片陶瓷电容; Author: 叶建峰
Q7 = DMP3098L: as Q1 on sheet EnvMonitor
R47-R49 = RES_0603: OEMs: *; Type: 10KΩ; Package: 0603

## Sheet Charge.SchDoc
size A4
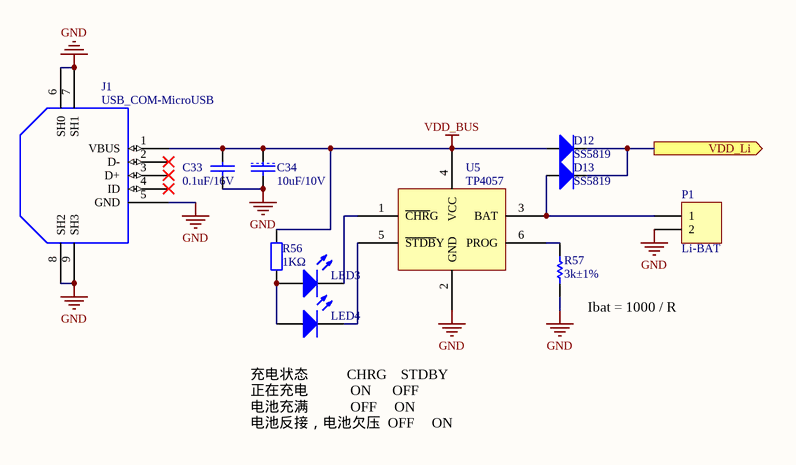
[diagram p5: Charge.SchDoc]

### Parts
C33  0.1uF/16V  [0603R]
C34  10uF/10V  [0805R]
D12  SS5819  [SMA]
D13  SS5819  [SMA]
J1  USB_COM-MicroUSB  [USB_MINIB_SMT]
LED3  LED-0805  [LED-0603]  (value not drawn)
LED4  LED-0805  [LED-0603]  (value not drawn)
P1  Li-BAT  [CON2-2.0]
R56  1KΩ  [0603R]
R57  3k±1%  [0603R]
U5  TP4057  [SOT23-6]

### Ports
VDD_Li (out)

### Nets
GND: C33.2 C34.2 J1.5(GND) J1.6(SH0) J1.7(SH1) J1.8(SH2) J1.9(SH3) P1.2 R57.1 U5.2(GND)
VDD_BUS: C33.1 C34.1 D12.1(A) J1.1(VBUS) R56.1 U5.4(VCC)
P0.05: D12.2(K) D13.2(K) ; port VDD_Li
NetD13_1: D13.1(A) P1.1 U5.3(BAT)
NetLED3_1: LED3.1(A) LED4.1(A) R56.2
NetLED3_2: LED3.2(K) U5.1(~{CHR}G)
NetLED4_2: LED4.2(K) U5.5(~{STDB}Y)
NetR57_2: R57.2 U5.6(PROG)

Not connected (* = marked no-connect by the designer): J1 2(D-)* 3(D+)* 4(ID)*

### Notes on the sheet
- (near R57) Ibat = 1000 / R
- (near LED4) 充电状态           CHRG    STDBY
  正在充电            ON      OFF
  电池充满            OFF     ON
  电池反接，电池欠压  OFF     ON
- Drawing Name
- 图纸名称
- Drawing
- 制图
- Auditing
- 审核
- EnvMonitor
- Confirming
- 批准
- Version
- 版本号
- 小甘工作室
- V1.00
- 日期
- Date
- Jack
- XiaoGan Studio

### Library data of the parts
C33 C34 = CAP: 贴片陶瓷电容; Kind: 贴片陶瓷电容
  C34: Author: 叶建峰
D12 D13 = Diode 1N914: 贴片二极管; Remark: 可用1N5819替代; Kind: 贴片二极管; Author: 叶建峰
J1 = USB_COM-MiniUSB: Text Field1: 100; Text Field2: 80
LED3 LED4 = LED_0603: as LED1 on sheet EnvMonitor; Type: RED; Package: 0603
P1 = Header 2: Header, 2-Pin; LatestRevisionDate: 17-Jul-2002; LatestRevisionNote: Re-released for DXP Platform.; Publisher: Altium Limited
R56 = RES_0603: OEMs: *; Type: 10KΩ; Package: 0603
R57 = Res1: 贴片电阻; Kind: 贴片电阻
U5 = TP4057: 锂电充电芯片; Manufacturer: 南京拓微集成电路; Kind: 集成电路; Remark: 关键元器件; Author: 叶建峰

## Nets that join several sheets
GND: EnvMonitor (23 pins), Radio (29 pins), Flash (5 pins), Power (13 pins), I2C (C31.2 R48.1 U3.3), Charge (10 pins)
VDD_1Wire: EnvMonitor (Q4.3), I2C (5 pins)
VDD_3V3: EnvMonitor (13 pins), Radio (C24.1 C30.1 U2.1 U2.12), Power (6 pins)
VDD_Flash: EnvMonitor (Q1.3), Flash (D11.1)
IO_1Wire: EnvMonitor (P3.7 TP4.0), I2C (Q7.3 R49.2 U3.2)
nSFLASH_WP: EnvMonitor (R14.2), Flash (P7.2 R55.1 U4.9)
P0.00/Vref0: EnvMonitor (R1.1), Radio (U2.4)
P0.01: EnvMonitor (P2.2), Radio (D2.1 D5.2 R42.1)
P0.02: EnvMonitor (P2.3), Radio (D3.1 D6.2 R43.1)
P0.03: EnvMonitor (P2.4), Radio (D7.1 D9.2 R45.1)
P0.04: EnvMonitor (P2.5), Radio (D8.1 D10.2 R46.1)
P0.05: Radio (R40.2), Power (Q8#1.2 R3#1.2 R11#1.2), Charge (D12.2 D13.2)
P0.06: EnvMonitor (C35.2 R9.1 S3.2), Radio (U2.10)
P0.07: Radio (U2.11), Power (R15#1.2 TP6.0)
P0.08: EnvMonitor (P4.7 R28.2), Radio (U2.14)
P0.09: EnvMonitor (P4.6 R26.2), Radio (U2.15)
P0.10: EnvMonitor (P4.5 R23.2), Radio (U2.16)
P0.11: EnvMonitor (P4.4 R21.2), Radio (U2.17)
P0.12: EnvMonitor (P4.3 R20.2), Radio (U2.18)
P0.13: EnvMonitor (P4.2 R18.2), Radio (U2.19)
P0.14: EnvMonitor (R10.1), Radio (U2.20)
P0.15: EnvMonitor (R8.1), Radio (U2.21)
P0.16: EnvMonitor (R13.1), Radio (U2.22)
P0.17: EnvMonitor (R14.1), Radio (U2.25)
P0.18: EnvMonitor (R7.2 TP1.0), Radio (U2.26)
P0.19: EnvMonitor (R34.1), Radio (U2.27)
P0.20: EnvMonitor (R33.1), Radio (U2.28)
P0.21: EnvMonitor (R25.1), Radio (U2.40)
P0.22: EnvMonitor (R27.1), Radio (U2.41)
P0.23: EnvMonitor (P3.4 R51.1), Radio (U2.42)
P0.24: EnvMonitor (P3.3 R50.1), Radio (U2.43)
P0.25: EnvMonitor (P6.5 R39.1), Radio (U2.44)
P0.26: EnvMonitor (P6.4 R38.1), Radio (SB3.2)
P0.27: EnvMonitor (P6.3 R37.1), Radio (SB1.2)
P0.28: EnvMonitor (R31.2 TP3.0), Radio (U2.47)
P0.29: EnvMonitor (P6.2 R36.1), Radio (U2.48)
P0.30: EnvMonitor (R22.2 TP2.0), Radio (U2.3)
SCL_1Wire: EnvMonitor (P3.6 R5.2 R25.2), I2C (U3.4)
SDA_1Wire: EnvMonitor (P3.5 R6.2 R27.2), I2C (U3.5)
SFLASH_MISO: EnvMonitor (R13.2), Flash (P7.1 U4.8)
SFLASH_MOSI: EnvMonitor (R10.2), Flash (P7.3 U4.15)
SFLASH_SCK: EnvMonitor (R8.2), Flash (P7.4 U4.16)
SWCLK: EnvMonitor (P5.2), Radio (U2.24)
SWDIO: EnvMonitor (P5.3 S1.2), Radio (U2.23)
VDD_VREF: EnvMonitor (R1.2), Power (C10#1.1 T1#1.1 TP8.0)